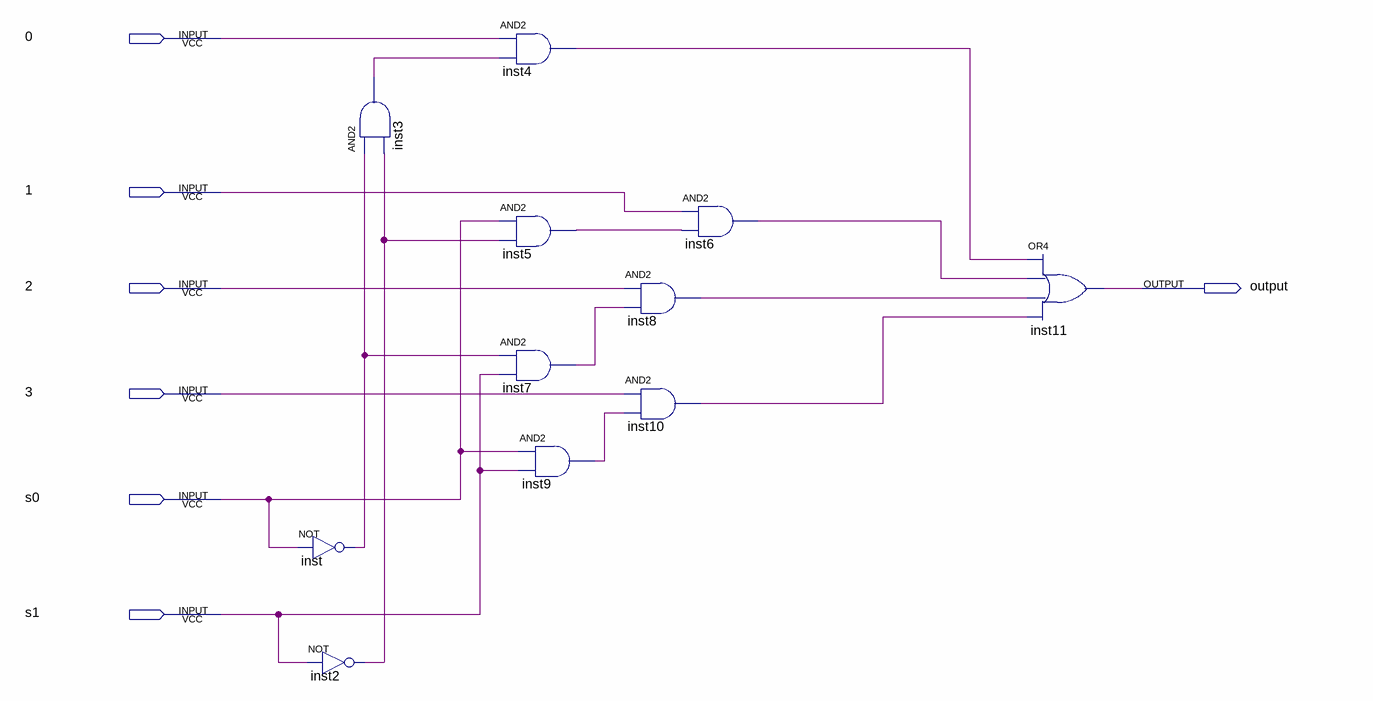
[diagram p0: schematic sheet]
// Quartus schematic Block4.bdf as structural Verilog: 11 symbols, 7 pins
module Block4 (
  input  \0 ,
  input  \1 ,
  input  \2 ,
  input  \3 ,
  input  s0,
  input  s1,
  output \output 
);

  wire inst2_out, inst3_out, inst4_out, inst5_out, inst6_out, inst7_out, inst8_out, inst9_out, inst10_out,
       inst_out;

  not inst (inst_out, s0);
  not inst2 (inst2_out, s1);
  and inst3 (inst3_out, inst_out, inst2_out);
  and inst4 (inst4_out, \0 , inst3_out);
  and inst5 (inst5_out, s0, inst2_out);
  and inst7 (inst7_out, inst_out, s1);
  and inst9 (inst9_out, s0, s1);
  and inst8 (inst8_out, \2 , inst7_out);
  and inst10 (inst10_out, \3 , inst9_out);
  and inst6 (inst6_out, \1 , inst5_out);
  or inst11 (\output , inst4_out, inst6_out, inst8_out, inst10_out);
endmodule
